# Altium project QCopterMV-Expand.PrjPCB
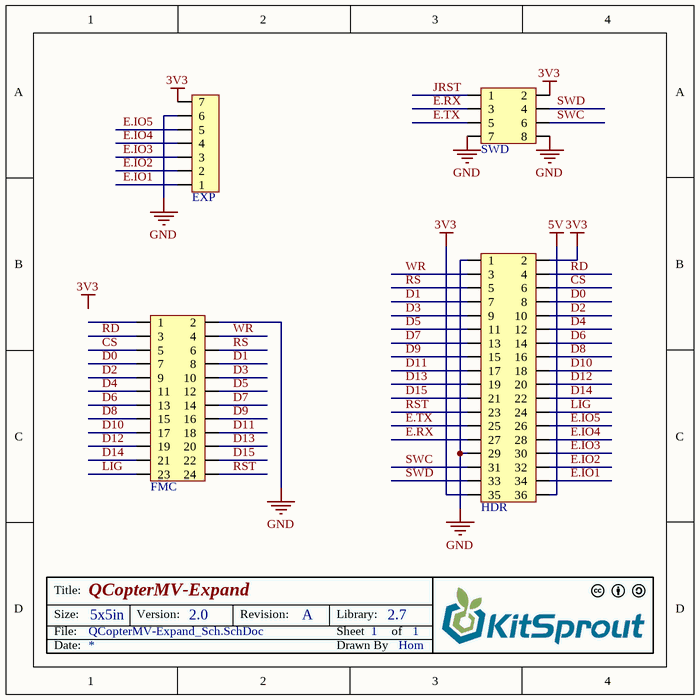
[diagram p0: QCopterMV-Expand_Sch.SchDoc]
1 sheet, 4 parts. Net scope: global (net labels, ports and power ports of the same name join across sheets).
Board file: QCopterMV-Expand_Pcb.PcbDoc

## Sheet QCopterMV-Expand_Sch.SchDoc: QCopterMV-Expand
size 127 x 127 mm; Author: Hom; CompanyName: KitSprout; DrawnBy: Hom; Engineer: Hom; Organization: KitSprout; Revision: A; SheetNumber: 1; SheetTotal: 1; Version: 2.0; LibVersion: 2.7; PageSetup: Record=PageOptions|CenterHorizontal=True|CenterVertical=True|PrintScale=1.00|XCorrection=1.00|YCorrection=1.00|PrintKind=0|BorderSize=5000000|LeftOffset=0|BottomOffset=0|Orientation=2|PaperLength=1000|PaperWidth=1000|Scale=100|PaperSource=7|PrintQuality=-3|MediaType=1|DitherType=10|PrintScaleMode=0|PaperKind=A4|PaperIndex=9

### Parts
EXP  HDR1x7_2.54  [HDR1X7_2.54_180H]  (value not drawn)
FMC  HDR2x12_2.54  [HDR2X12_2.54_180HF]  (value not drawn)
HDR  HDR2x18_1.27  [HDR2X18_1.27_180H]  (value not drawn)
SWD  HDR2x4_2.54  [HDR2X4_2.54_180HF]  (value not drawn)

### Nets
3V3: EXP.7 HDR.2 HDR.35 SWD.2
5V: HDR.36
GND: EXP.6 FMC.2 HDR.1 HDR.29 SWD.7 SWD.8
CS: FMC.5 HDR.6
D0: FMC.7 HDR.8
D1: FMC.8 HDR.7
D2: FMC.9 HDR.10
D3: FMC.10 HDR.9
D4: FMC.11 HDR.12
D5: FMC.12 HDR.11
D6: FMC.13 HDR.14
D7: FMC.14 HDR.13
D8: FMC.15 HDR.16
D9: FMC.16 HDR.15
D10: FMC.17 HDR.18
D11: FMC.18 HDR.17
D12: FMC.19 HDR.20
D13: FMC.20 HDR.19
D14: FMC.21 HDR.22
D15: FMC.22 HDR.21
E.IO1: EXP.1 HDR.34
E.IO2: EXP.2 HDR.32
E.IO3: EXP.3 HDR.30
E.IO4: EXP.4 HDR.28
E.IO5: EXP.5 HDR.26
E.RX: HDR.27 SWD.3
E.TX: HDR.25 SWD.5
JRST: SWD.1
LIG: FMC.23 HDR.24
RD: FMC.3 HDR.4
RS: FMC.6 HDR.5
RST: FMC.24 HDR.23
SWC: HDR.31 SWD.6
SWD: HDR.33 SWD.4
WR: FMC.4 HDR.3

Not connected (* = marked no-connect by the designer): FMC 1

### Notes on the sheet
- Title:
- Size:
- Date:
- File:
- 5x5in
- Version:
- Revision:
- Sheet
- Drawn By
- Library:
- of
- Labels drawn without touching a wire or pin: 3V3

### Library data of the parts
EXP = HDR1x7_2.54T: Header
FMC = HDR2x12_2.54: Header
HDR = HDR2x18_1.27: Header
SWD = HDR2x4_2.54: Header